# EAGLE design homeboard2 (EAGLE 6.0)
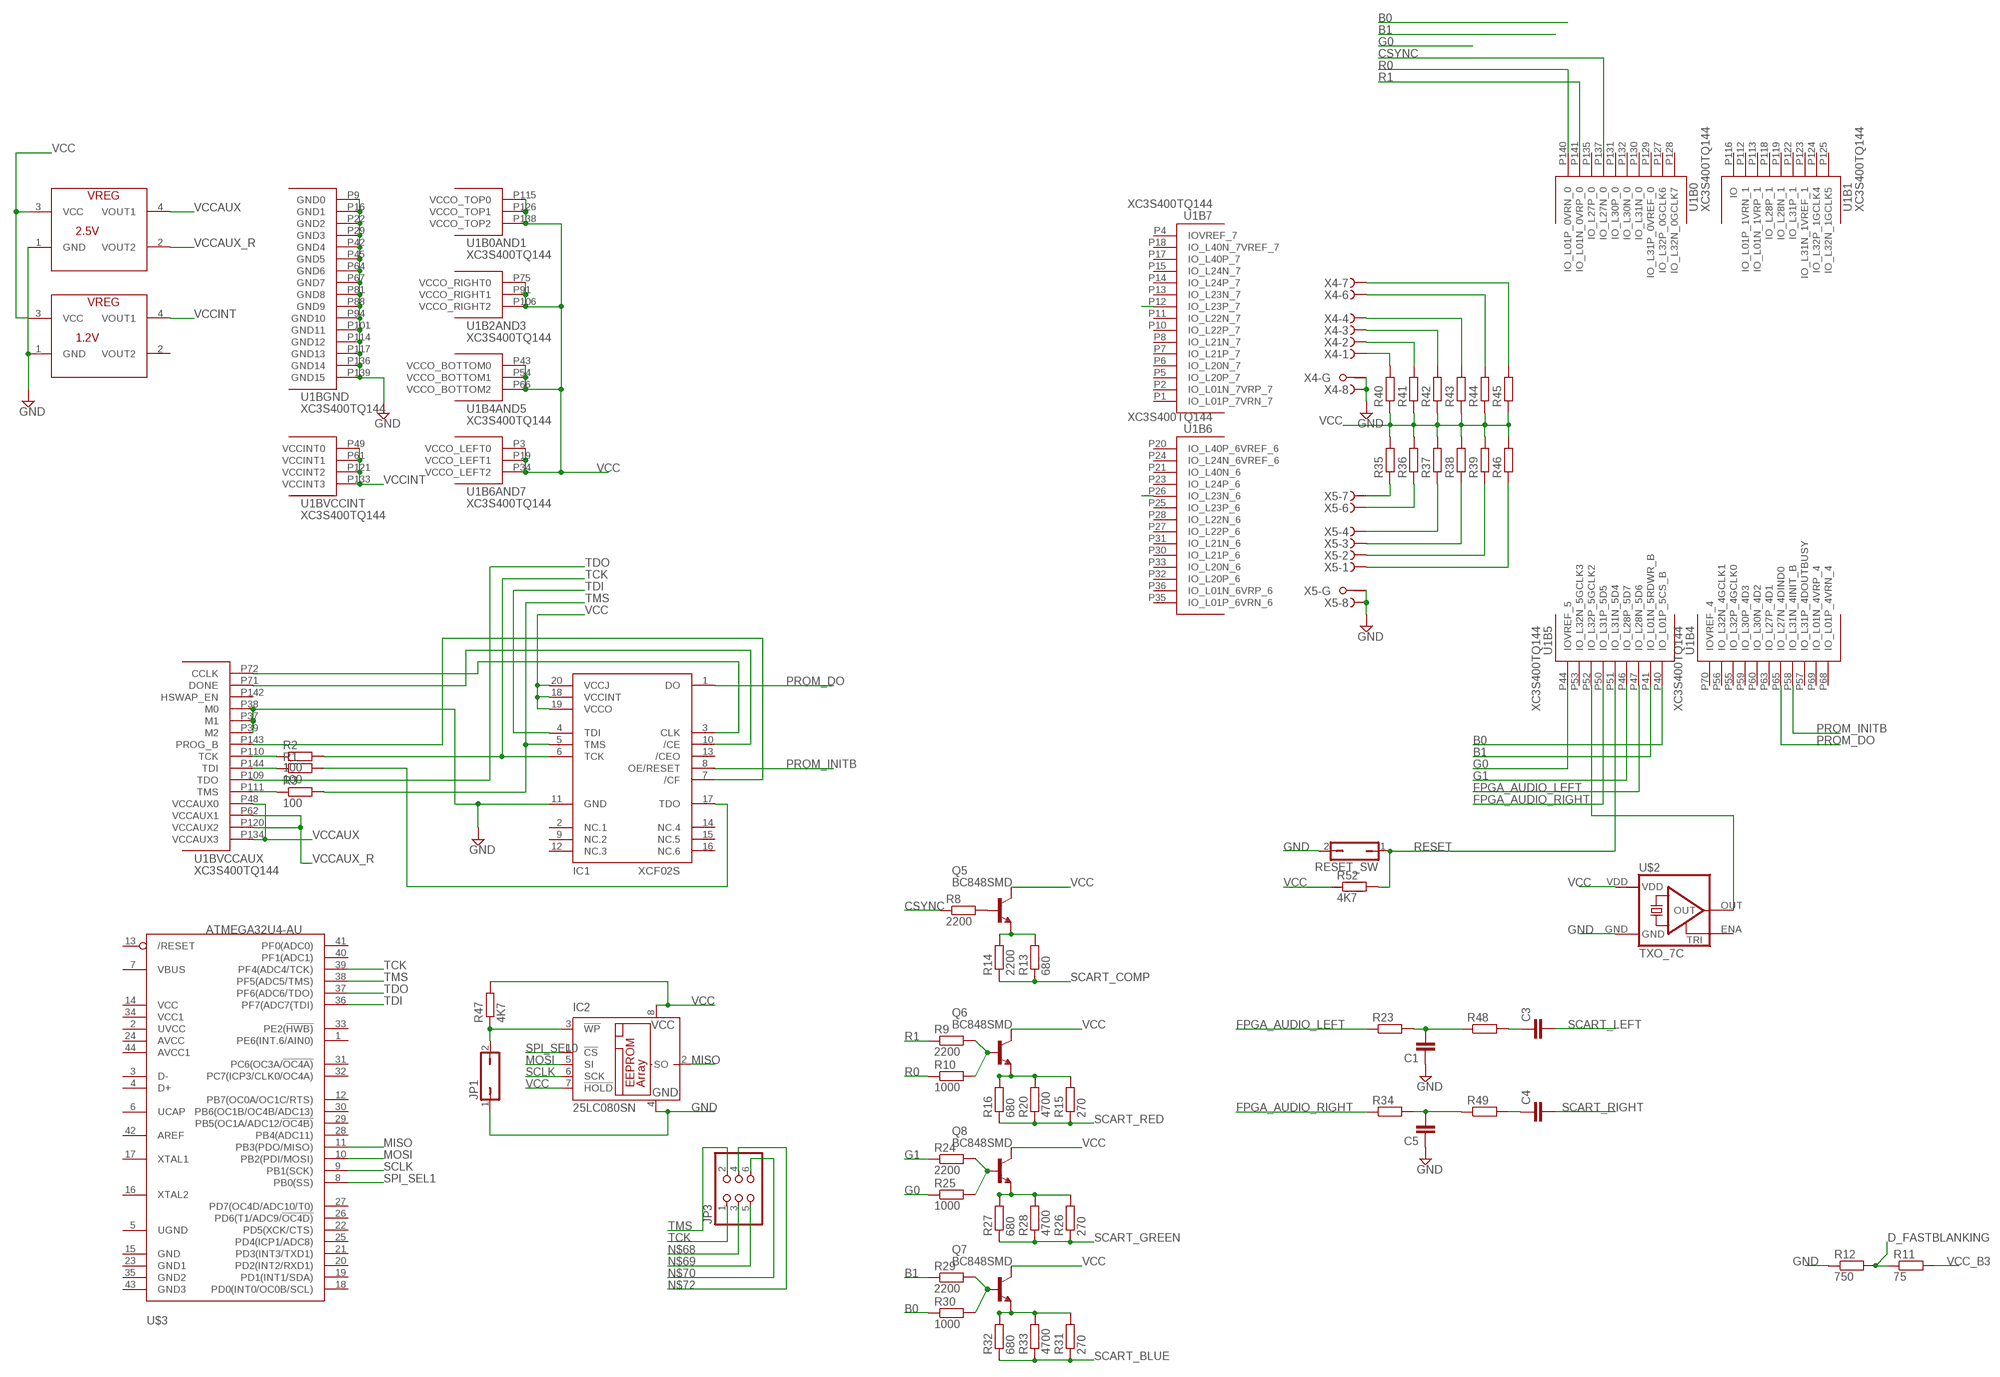
[diagram p0: schematic, sheet 1, part 1 of 3]
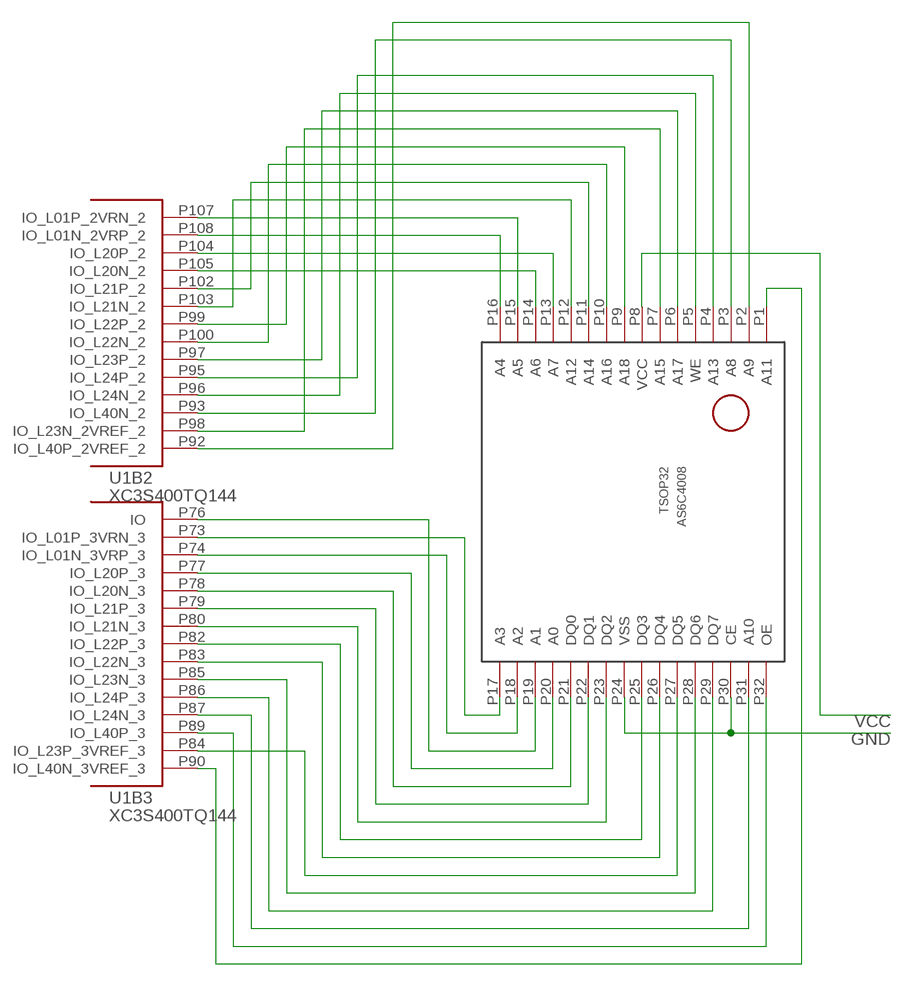
[diagram p1: schematic, sheet 1, part 2 of 3]
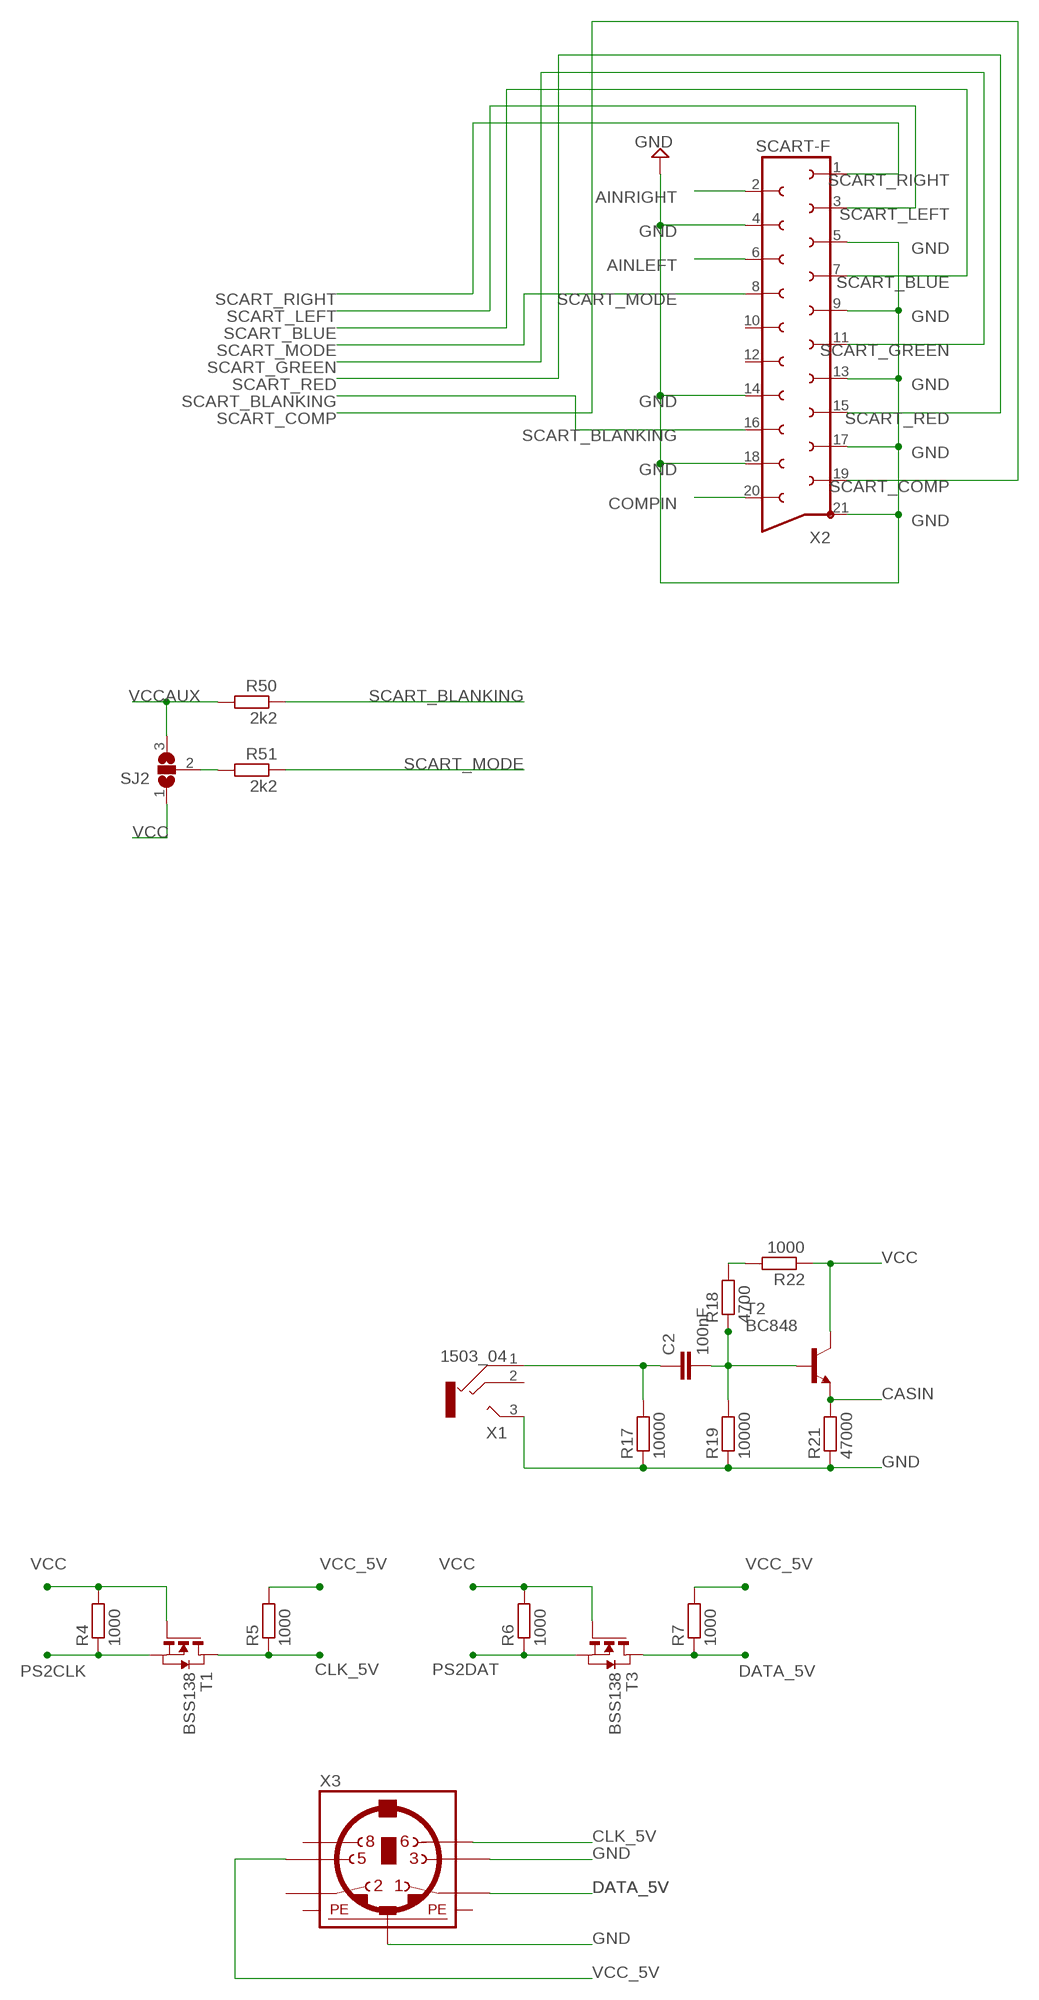
[diagram p2: schematic, sheet 1, part 3 of 3]

## Parts
C1  C-EUC0603  [C0603]
C2  100nF  C-EUC0603  [C0603]
C3  C-EUC0603  [C0603]
C4  C-EUC0603  [C0603]
C5  C-EUC0603  [C0603]
IC1  XCF02S  [VO20]
IC2  25LC080SN  [SO-08]
JP1  JP1Q  [JP1]
JP3  PINHD-2X3  [2X03]
Q5  BC848SMD  [SOT23]
Q6  BC848SMD  [SOT23]
Q7  BC848SMD  [SOT23]
Q8  BC848SMD  [SOT23]
R1  100  R-EU_R0805  [R0805]
R2  100  R-EU_R0805  [R0805]
R3  100  R-EU_R0805  [R0805]
R4  1000  R-EU_R0805  [R0805]
R5  1000  R-EU_R0805  [R0805]
R6  1000  R-EU_R0805  [R0805]
R7  1000  R-EU_R0805  [R0805]
R8  2200  R-EU_R0805  [R0805]
R9  2200  R-EU_R0805  [R0805]
R10  1000  R-EU_R0805  [R0805]
R11  75  R-EU_R0805  [R0805]
R12  750  R-EU_R0805  [R0805]
R13  680  R-EU_R0805  [R0805]
R14  2200  R-EU_R0805  [R0805]
R15  270  R-EU_R0805  [R0805]
R16  680  R-EU_R0805  [R0805]
R17  10000  R-EU_R0805  [R0805]
R18  4700  R-EU_R0805  [R0805]
R19  10000  R-EU_R0805  [R0805]
R20  4700  R-EU_R0805  [R0805]
R21  47000  R-EU_R0805  [R0805]
R22  1000  R-EU_R0805  [R0805]
R23  R-EU_M0805  [M0805]
R24  2200  R-EU_R0805  [R0805]
R25  1000  R-EU_R0805  [R0805]
R26  270  R-EU_R0805  [R0805]
R27  680  R-EU_R0805  [R0805]
R28  4700  R-EU_R0805  [R0805]
R29  2200  R-EU_R0805  [R0805]
R30  1000  R-EU_R0805  [R0805]
R31  270  R-EU_R0805  [R0805]
R32  680  R-EU_R0805  [R0805]
R33  4700  R-EU_R0805  [R0805]
R34  R-EU_M0805  [M0805]
R35  R-EU_M0805  [M0805]
R36  R-EU_M0805  [M0805]
R37  R-EU_M0805  [M0805]
R38  R-EU_M0805  [M0805]
R39  R-EU_M0805  [M0805]
R40  R-EU_M0805  [M0805]
R41  R-EU_M0805  [M0805]
R42  R-EU_M0805  [M0805]
R43  R-EU_M0805  [M0805]
R44  R-EU_M0805  [M0805]
R45  R-EU_M0805  [M0805]
R46  R-EU_M0805  [M0805]
R47  4K7  R-EU_R0805  [R0805]
R48  R-EU_M0805  [M0805]
R49  R-EU_M0805  [M0805]
R50  2k2  R-EU_M0805  [M0805]
R51  2k2  R-EU_M0805  [M0805]
R52  4K7  R-EU_M0805  [M0805]
REG1.2  1.2V  NX1117  [SOT223]
REG2.5  2.5V  NX1117  [SOT223]
RESET_SW  JP1Q  [JP1]
SJ2  SJ2W  [SJ_2]
T1  BSS138  NMOSSOT23  [SOT-23]
T2  BC848  [SOT23]
T3  BSS138  NMOSSOT23  [SOT-23]
U1  XC3S400TQ144  [TQ144]
U$1  AS6C4008  [TSOP32]
U$2  TXO_7C  [OSC_7C]
U$3  ATMEGA32U4-AU  [TQFP44]
X1  1503_04  [1503_04]
X2  SCART-F  [SCART-F]
X3  MINI_DIN_6  [M_DIN6]
X4  F09HPS  [F09HP]
X5  F09HPS  [F09HP]

## Nets
AINLEFT: X2.6
AINRIGHT: X2.2
B0: R30.1 U1.P40(B5:IO_L01P_5CS_B)
B1: R29.1 U1.P41(B5:IO_L01N_5RDWR_B)
CASIN: R21.2 T2.2(E)
CLK_5V: R5.1 T1.1(D) X3.6
COMPIN: X2.20
CSYNC: R8.1 U1.P137(B0:IO_L27N_0)
D_FASTBLANKING: R11.1 R12.2
DATA_5V: R7.1 T3.1(D) X3.1
FPGA_AUDIO_LEFT: R23.1 U1.P47(B5:IO_L28N_5D6)
FPGA_AUDIO_RIGHT: R34.1 U1.P50(B5:IO_L31P_5D5)
G0: R25.1 U1.P44(B5:IOVREF_5)
G1: R24.1 U1.P46(B5:IO_L28P_5D7)
GND: C1.1 C5.1 IC1.11(GND) IC2.4(GND) JP1.1 R12.1 R17.1 R19.1 R21.1 REG1.2.1(GND) REG2.5.1(GND) RESET_SW.2 U1.P9(BGND:GND0) U1.P16(BGND:GND1) U1.P22(BGND:GND2) U1.P29(BGND:GND3) U1.P37(BVCCAUX:M1) U1.P38(BVCCAUX:M0) U1.P39(BVCCAUX:M2) U1.P42(BGND:GND4) U1.P45(BGND:GND5) U1.P64(BGND:GND6) U1.P67(BGND:GND7) U1.P81(BGND:GND8) U1.P88(BGND:GND9) U1.P94(BGND:GND10) U1.P101(BGND:GND11) U1.P114(BGND:GND12) U1.P117(BGND:GND13) U1.P136(BGND:GND14) U1.P139(BGND:GND15) U$1.P24(VSS) U$1.P30(CE) U$2.GND X1.3 X2.4 X2.5 X2.9 X2.13 X2.14 X2.17 X2.18 X2.21 X3.3 X3.SH2(PE2) X4.8(-8:F) X4.G1(-G:G1) X5.8(-8:F) X5.G1(-G:G1)
MISO: IC2.2(SO) U$3.11(PB3(PDO/MISO))
MOSI: IC2.5(SI) U$3.10(PB2(PDI/MOSI))
N$1: U1.P108(B2:IO_L01N_2VRP_2) U$1.P16(A4)
N$2: U1.P107(B2:IO_L01P_2VRN_2) U$1.P15(A5)
N$3: U1.P105(B2:IO_L20N_2) U$1.P14(A6)
N$4: U1.P104(B2:IO_L20P_2) U$1.P13(A7)
N$5: U1.P103(B2:IO_L21N_2) U$1.P12(A12)
N$6: U1.P102(B2:IO_L21P_2) U$1.P11(A14)
N$7: U1.P100(B2:IO_L22N_2) U$1.P10(A16)
N$8: U1.P99(B2:IO_L22P_2) U$1.P9(A18)
N$9: U1.P98(B2:IO_L23N_2VREF_2) U$1.P7(A15)
N$10: U1.P97(B2:IO_L23P_2) U$1.P6(A17)
N$11: U1.P96(B2:IO_L24N_2) U$1.P5(WE)
N$12: U1.P95(B2:IO_L24P_2) U$1.P4(A13)
N$13: U1.P93(B2:IO_L40N_2) U$1.P3(A8)
N$14: U1.P92(B2:IO_L40P_2VREF_2) U$1.P2(A9)
N$15: U1.P90(B3:IO_L40N_3VREF_3) U$1.P1(A11)
N$16: U1.P73(B3:IO_L01P_3VRN_3) U$1.P17(A3)
N$17: U1.P74(B3:IO_L01N_3VRP_3) U$1.P18(A2)
N$18: U1.P76(B3:IO) U$1.P19(A1)
N$19: U1.P77(B3:IO_L20P_3) U$1.P20(A0)
N$20: U1.P78(B3:IO_L20N_3) U$1.P21(DQ0)
N$21: U1.P79(B3:IO_L21P_3) U$1.P22(DQ1)
N$22: U1.P80(B3:IO_L21N_3) U$1.P23(DQ2)
N$23: U1.P82(B3:IO_L22P_3) U$1.P25(DQ3)
N$24: U1.P83(B3:IO_L22N_3) U$1.P26(DQ4)
N$25: U1.P84(B3:IO_L23P_3VREF_3) U$1.P27(DQ5)
N$26: U1.P85(B3:IO_L23N_3) U$1.P28(DQ6)
N$27: U1.P86(B3:IO_L24P_3) U$1.P29(DQ7)
N$28: U1.P87(B3:IO_L24N_3) U$1.P31(A10)
N$29: U1.P89(B3:IO_L40P_3) U$1.P32(OE)
N$30: R35.1 X5.7(-7:F)
N$31: R36.1 X5.6(-6:F)
N$32: R37.1 X5.4(-4:F)
N$33: R38.1 X5.3(-3:F)
N$34: R39.1 X5.2(-2:F)
N$35: IC1.3(CLK) U1.P72(BVCCAUX:CCLK)
N$36: IC1.17(TDO) R1.2
N$37: R46.1 X5.1(-1:F)
N$38: IC1.10(/CE) U1.P71(BVCCAUX:DONE)
N$39: R2.1 U1.P110(BVCCAUX:TCK)
N$40: IC1.7(/CF) U1.P143(BVCCAUX:PROG_B)
N$41: R40.2 X4.1(-1:F)
N$42: R1.1 U1.P144(BVCCAUX:TDI)
N$43: R3.1 U1.P111(BVCCAUX:TMS)
N$44: R41.2 X4.2(-2:F)
N$45: R42.2 X4.3(-3:F)
N$46: R43.2 X4.4(-4:F)
N$47: R44.2 X4.6(-6:F)
N$48: R45.2 X4.7(-7:F)
N$49: IC2.3(!WP) JP1.2 R47.1
N$50: U1.P52(B5:IO_L32P_5GCLK2) U$2.OUT
N$51: C1.2 R23.2 R48.1
N$52: C3.1 R48.2
N$53: Q6.1(B) R9.2 R10.2
N$54: Q6.2(E) R15.2 R16.2 R20.2
N$55: Q8.1(B) R24.2 R25.2
N$56: Q8.2(E) R26.2 R27.2 R28.2
N$57: Q7.1(B) R29.2 R30.2
N$58: Q7.2(E) R31.2 R32.2 R33.2
N$59: Q5.2(E) R13.2 R14.2
N$60: C2.2 R18.1 R19.2 T2.1(B)
N$61: C2.1 R17.2 X1.1
N$62: R18.2 R22.2
N$63: Q5.1(B) R8.2
N$64: C4.1 R49.2
N$65: C5.2 R34.2 R49.1
N$66: R51.2 SJ2.2
N$67: U1.P26(B6:IO_L23N_6)
N$68: JP3.3
N$69: JP3.5
N$70: JP3.6
N$72: JP3.4
N$73: U1.P12(B7:IO_L23P_7)
PROM_DO: IC1.1(DO) U1.P65(B4:IO_L27N_4DIND0)
PROM_INITB: IC1.8(OE/RESET) U1.P58(B4:IO_L31N_4INIT_B)
PS2CLK: R4.1 T1.2(S)
PS2DAT: R6.1 T3.2(S)
R0: R10.1 U1.P140(B0:IO_L01P_0VRN_0)
R1: R9.1 U1.P141(B0:IO_L01N_0VRP_0)
RESET: R52.2 RESET_SW.1 U1.P51(B5:IO_L31N_5D4)
SCART_BLANKING: R50.1 X2.16
SCART_BLUE: R31.1 R32.1 R33.1 X2.7
SCART_COMP: R13.1 R14.1 X2.19
SCART_GREEN: R26.1 R27.1 R28.1 X2.11
SCART_LEFT: C3.2 X2.3
SCART_MODE: R51.1 X2.8
SCART_RED: R15.1 R16.1 R20.1 X2.15
SCART_RIGHT: C4.2 X2.1
SCLK: IC2.6(SCK) U$3.9(PB1(SCK))
SPI_SEL0: IC2.1(!CS)
SPI_SEL1: U$3.8(PB0(SS))
TCK: IC1.6(TCK) JP3.1 R2.2 U$3.39(PF4(ADC4/TCK))
TDI: IC1.4(TDI) U$3.36(PF7(ADC7(TDI))
TDO: U1.P109(BVCCAUX:TDO) U$3.37(PF6(ADC6/TDO))
TMS: IC1.5(TMS) JP3.2 R3.2 U$3.38(PF5(ADC5/TMS))
VCC: IC1.18(VCCINT) IC1.19(VCCO) IC1.20(VCCJ) IC2.7(!HOLD) IC2.8(VCC) Q5.3(C) Q6.3(C) Q7.3(C) Q8.3(C) R4.2 R6.2 R22.1 R35.2 R36.2 R37.2 R38.2 R39.2 R40.1 R41.1 R42.1 R43.1 R44.1 R45.1 R46.2 R47.2 R52.1 REG1.2.3(VCC) REG2.5.3(VCC) SJ2.1 T1.3(G) T2.3(C) T3.3(G) U1.P3(B6AND7:VCCO_LEFT0) U1.P19(B6AND7:VCCO_LEFT1) U1.P34(B6AND7:VCCO_LEFT2) U1.P43(B4AND5:VCCO_BOTTOM0) U1.P54(B4AND5:VCCO_BOTTOM1) U1.P66(B4AND5:VCCO_BOTTOM2) U1.P75(B2AND3:VCCO_RIGHT0) U1.P91(B2AND3:VCCO_RIGHT1) U1.P106(B2AND3:VCCO_RIGHT2) U1.P115(B0AND1:VCCO_TOP0) U1.P126(B0AND1:VCCO_TOP1) U1.P138(B0AND1:VCCO_TOP2) U$1.P8(VCC) U$2.VDD
VCC_5V: R5.2 R7.2 X3.5
VCC_B3: R11.2
VCCAUX: R50.2 REG2.5.4(VOUT1) SJ2.3 U1.P48(BVCCAUX:VCCAUX0) U1.P134(BVCCAUX:VCCAUX3)
VCCAUX_R: REG2.5.2(VOUT2) U1.P62(BVCCAUX:VCCAUX1) U1.P120(BVCCAUX:VCCAUX2)
VCCINT: REG1.2.4(VOUT1) U1.P49(BVCCINT:VCCINT0) U1.P61(BVCCINT:VCCINT1) U1.P121(BVCCINT:VCCINT2) U1.P133(BVCCINT:VCCINT3)
Unconnected: IC1.2(NC.1) IC1.9(NC.2) IC1.12(NC.3) IC1.13(/CEO) IC1.14(NC.4) IC1.15(NC.5) IC1.16(NC.6) REG1.2.2(VOUT2) U1.P1(B7:IO_L01P_7VRN_7) U1.P2(B7:IO_L01N_7VRP_7) U1.P4(B7:IOVREF_7) U1.P5(B7:IO_L20P_7) U1.P6(B7:IO_L20N_7) U1.P7(B7:IO_L21P_7) U1.P8(B7:IO_L21N_7) U1.P10(B7:IO_L22P_7) U1.P11(B7:IO_L22N_7) U1.P13(B7:IO_L23N_7) U1.P14(B7:IO_L24P_7) U1.P15(B7:IO_L24N_7) U1.P17(B7:IO_L40P_7) U1.P18(B7:IO_L40N_7VREF_7) U1.P20(B6:IO_L40P_6VREF_6) U1.P21(B6:IO_L40N_6) U1.P23(B6:IO_L24P_6) U1.P24(B6:IO_L24N_6VREF_6) U1.P25(B6:IO_L23P_6) U1.P27(B6:IO_L22P_6) U1.P28(B6:IO_L22N_6) U1.P30(B6:IO_L21P_6) U1.P31(B6:IO_L21N_6) U1.P32(B6:IO_L20P_6) U1.P33(B6:IO_L20N_6) U1.P35(B6:IO_L01P_6VRN_6) U1.P36(B6:IO_L01N_6VRP_6) U1.P53(B5:IO_L32N_5GCLK3) U1.P55(B4:IO_L32P_4GCLK0) U1.P56(B4:IO_L32N_4GCLK1) U1.P57(B4:IO_L31P_4DOUTBUSY) U1.P59(B4:IO_L30P_4D3) U1.P60(B4:IO_L30N_4D2) U1.P63(B4:IO_L27P_4D1) U1.P68(B4:IO_L01P_4VRN_4) U1.P69(B4:IO_L01N_4VRP_4) U1.P70(B4:IOVREF_4) U1.P112(B1:IO_L01P_1VRN_1) U1.P113(B1:IO_L01N_1VRP_1) U1.P116(B1:IO) U1.P118(B1:IO_L28P_1) U1.P119(B1:IO_L28N_1) U1.P122(B1:IO_L31P_1) U1.P123(B1:IO_L31N_1VREF_1) U1.P124(B1:IO_L32P_1GCLK4) U1.P125(B1:IO_L32N_1GCLK5) U1.P127(B0:IO_L32P_0GCLK6) U1.P128(B0:IO_L32N_0GCLK7) U1.P129(B0:IO_L31P_0VREF_0) U1.P130(B0:IO_L31N_0) U1.P131(B0:IO_L30P_0) U1.P132(B0:IO_L30N_0) U1.P135(B0:IO_L27P_0) U1.P142(BVCCAUX:HSWAP_EN) U$2.ENA(TRI) U$3.1(PE6(INT.6/AIN0)) U$3.2(UVCC) U$3.3(D-) U$3.4(D+) U$3.5(UGND) U$3.6(UCAP) U$3.7(VBUS) U$3.12(PB7(OC0A/OC1C/RTS)) U$3.13(/RESET) U$3.14(VCC) U$3.15(GND) U$3.16(XTAL2) U$3.17(XTAL1) U$3.18(PD0(INT0/OC0B/SCL)) U$3.19(PD1(INT1/SDA)) U$3.20(PD2(INT2/RXD1)) U$3.21(PD3(INT3/TXD1)) U$3.22(PD5(XCK/CTS)) U$3.23(GND1) U$3.24(AVCC) U$3.25(PD4(ICP1/ADC8)) U$3.26(PD6(T1/ADC9/!OC4D)) U$3.27(PD7(OC4D/ADC10/T0)) U$3.28(PB4(ADC11)) U$3.29(PB5(OC1A/ADC12/!OC4B)) U$3.30(PB6(OC1B/OC4B/ADC13)) U$3.31(PC6(OC3A/!OC4A)) U$3.32(PC7(ICP3/CLK0/OC4A)) U$3.33(PE2(!HWB)) U$3.34(VCC1) U$3.35(GND2) U$3.40(PF1(ADC1)) U$3.41(PF0(ADC0)) U$3.42(AREF) U$3.43(GND3) U$3.44(AVCC1) X1.2 X2.10 X2.12 X3.2 X3.8 X4.5(-5:F) X4.9(-9:F) X4.G2(-G:G2) X5.5(-5:F) X5.9(-9:F) X5.G2(-G:G2)

## Power pins joined to a net without a drawn wire
PE1: X3.SH1(PE1)
PE3: X3.SH3(PE3)

## Library data of the parts
C1-C5 = resistor:C-EU: CAPACITOR, European symbol
IC1 = smd-special:XCF02S
IC2 = microchip:25*: Serial EEPROM 4K/ 8K , SPI bus; MF: MICROCHIP; MPN: 25LC080/SN; OC_FARNELL: 1137302; OC_NEWARK: 96K4092
JP1 RESET_SW = jumper:JP1Q: JUMPER
JP3 = pinhead:PINHD-2X3: PIN HEADER
Q5-Q8 = bc548:BC848*: NPN Transistor
R1-R22 R24-R33 R47 = rcl:R-EU_: RESISTOR, European symbol
R23 R34-R46 R48-R52 = resistor:R-EU_: RESISTOR, European symbol
REG1.2 REG2.5 = cpcfpga:NX1117
SJ2 = jumper:SJ2W: SMD solder JUMPER
T1 T3 = zetex:NMOSSOT23: MOS FET; OC_FARNELL: unknown; OC_NEWARK: unknown
T2 = transistor:BC848: NPN TRANSISTOR
U1 = xilinx_spartan3_virtex4_and_5:XC3S400TQ144: Xilinx FPGA
U$1 = cpcfpga:AS6C4008
U$2 = cpcfpga:TXO_7C: TXC crystal oscillator http://www.txccrystal.com/images/pdf/7c.pdf
U$3 = adafruit:ATMEGA32U4: http://www.ladyada.net/library/eagle
X1 = con-lumberg:1503_04: Jack connectors according to JISC 6560, 3.5 mm, IP 57 Klinkensteckverbinder nach JISC 6560, 3,5 mm, IP 57 Source: http://www.lumberg.com/Produkte/PDFs/1503_04.pdf; OC_FARNELL: 1216981; OC_NEWARK: unknown
X2 = con-hirschmann:SCART-F: TV SCART CONNECTOR; OC_FARNELL: unknown; OC_NEWARK: unknown
X3 = mini_din:MINI_DIN_6
X4 X5 = con-subd:F09HPS: SUB-D; OC_FARNELL: unknown; OC_NEWARK: unknown

## Net classes
1 power: width 0.6 mm, drill 1.1 mm, clearance 0.4 mm

## Board
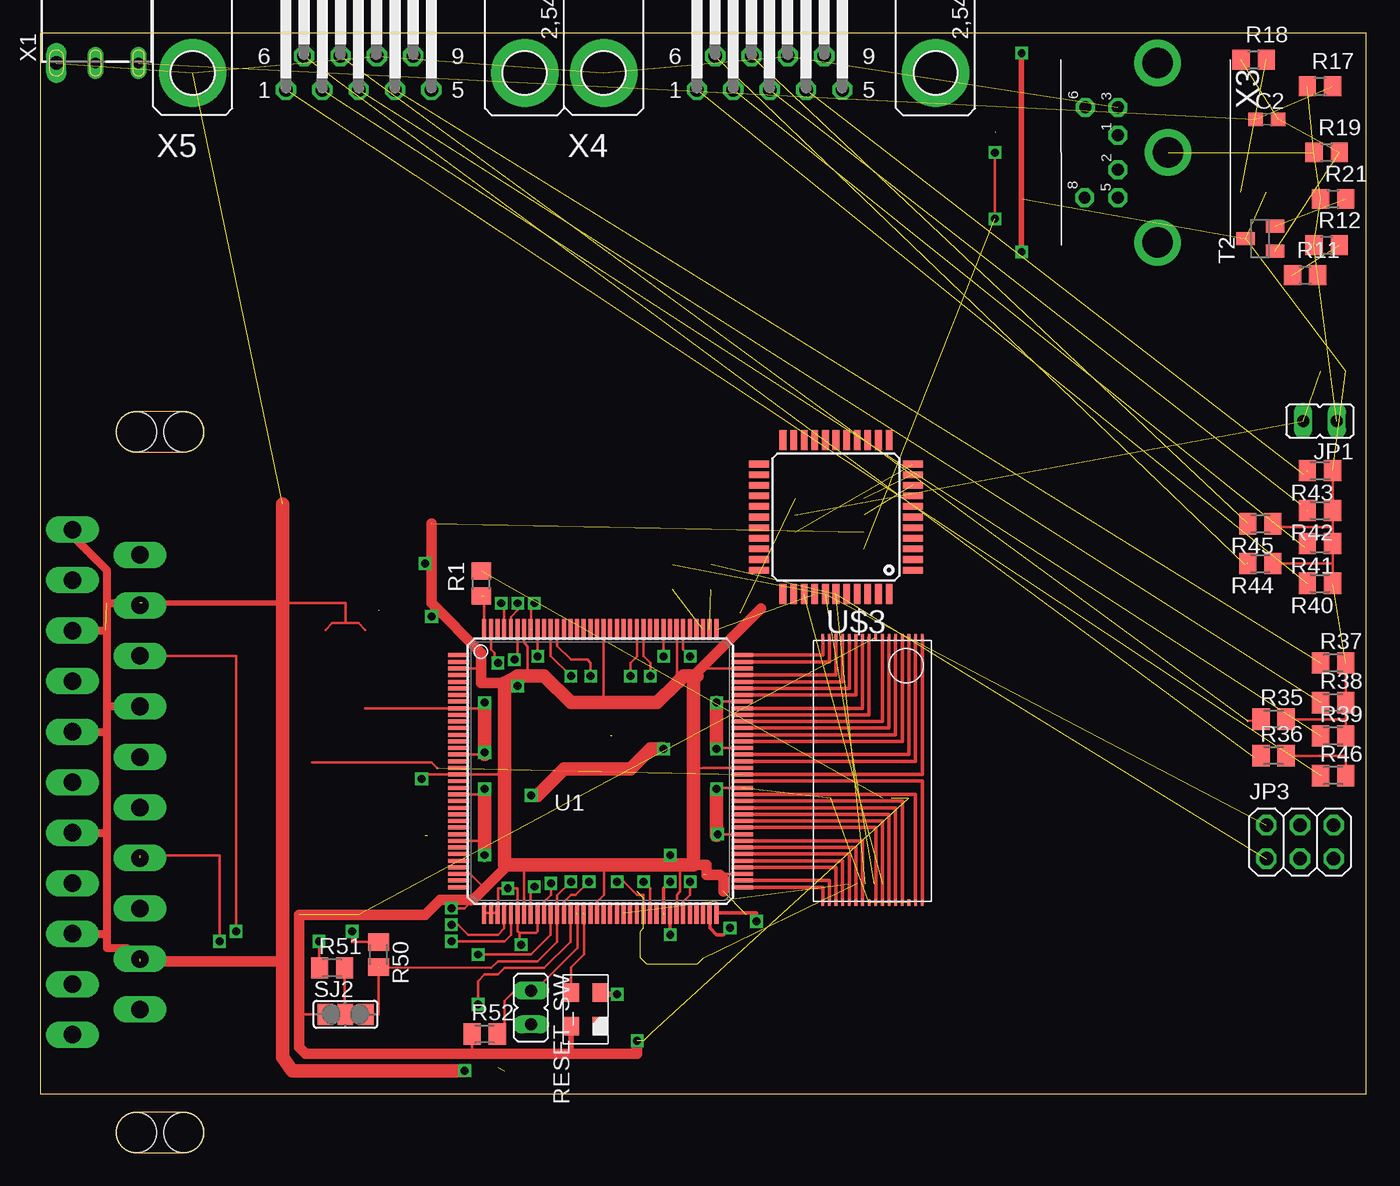
[diagram p3: board, top side]
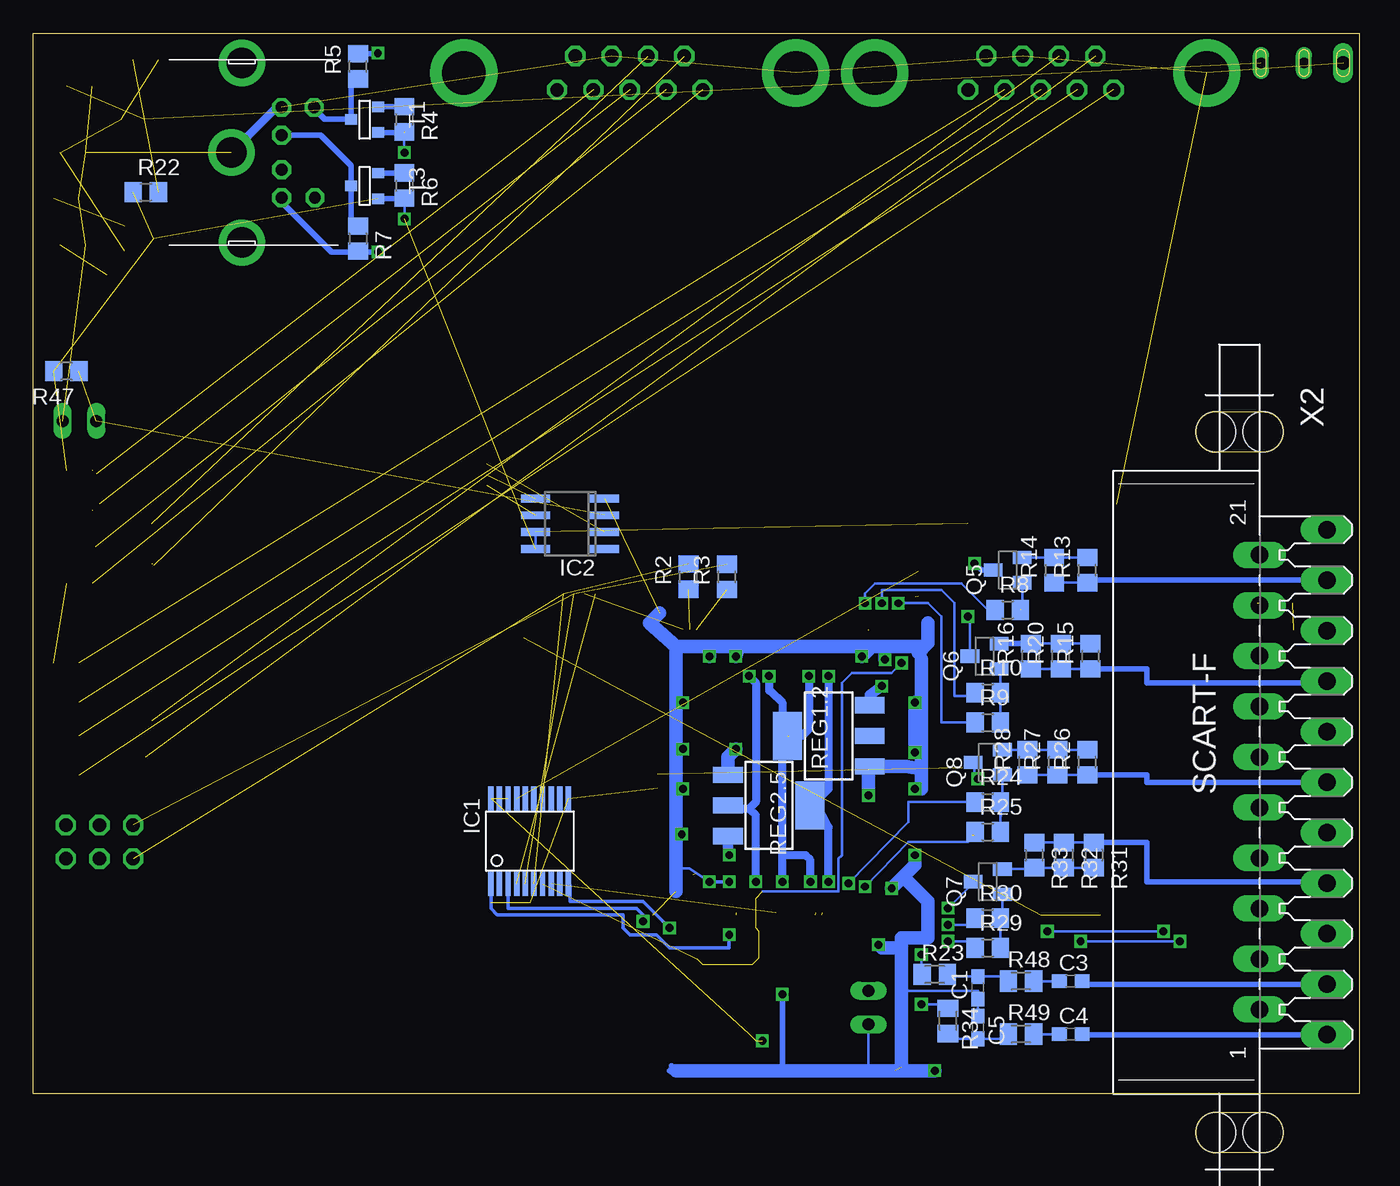
[diagram p4: board, bottom side, seen from below]

Size 100 x 80 mm. Coordinates in mm from the lower left corner, seen from the top.
Outline: 0,0 100,0 100,80 0,80 0,0
Copper layers (1*16): Top 0.0356mm / dielectric 1.5011mm / Bottom 0.0356mm
Design rules: minimum track width 6mil, minimum drill 13mil, track to track 6mil, track to pad 6mil, pad to pad 6mil, via to via 6mil, smd to smd 6mil, copper to edge 15mil, drill to drill 6mil, minimum pad ring 7mil, minimum via ring 7mil, stop-mask expansion 4mil, vias tented up to drill 0mil, thermal gap 10mil

### Footprints (pad centres in the part's own frame; a part is rotated, then mirrored left to right if it is on the bottom)
C0603 = smd 1.1 x 1: 1 -0.85,0; 2 0.85,0
VO20 = smd 0.4 x 1.8: 1 5.85,6.15; 2 5.2,6.15; 3 4.55,6.15; 4 3.9,6.15; 5 3.25,6.15; 6 2.6,6.15; 7 1.95,6.15; 8 1.3,6.15; 9 0.65,6.15; 10 0,6.15; 11 0,-0.3; 12 0.65,-0.3; 13 1.3,-0.3; 14 1.95,-0.3; 15 2.6,-0.3; 16 3.25,-0.3; 17 3.9,-0.3; 18 4.55,-0.3; 19 5.2,-0.3; 20 5.85,-0.3
SO-08 = smd 0.6 x 2.2: 1 -1.905,-2.6; 2 -0.635,-2.6; 3 0.635,-2.6; 4 1.905,-2.6; 5 1.905,2.6; 6 0.635,2.6; 7 -0.635,2.6; 8 -1.905,2.6
JP1 = drill 0.914 long: 1 0,-1.27; 2 0,1.27
2X03 = drill 1.016 octagon: 1 -2.54,-1.27; 2 -2.54,1.27; 3 0,-1.27; 4 0,1.27; 5 2.54,-1.27; 6 2.54,1.27
SOT23 = smd 1 x 1.4: 1 -0.95,-1.1; 2 0.95,-1.1; 3 0,1.1
R0805 = smd 1.3 x 1.5: 1 -0.95,0; 2 0.95,0
M0805 = smd 1.3 x 1.6: 1 -0.95,0; 2 0.95,0
SOT223 = smd 1.219 x 2.235: 1 -2.311,-3.099; 2 0,-3.099; 3 2.311,-3.099 | smd 3.6 x 2.2: 4 0,3.099
SJ_2 = smd 1.168 x 1.6: 1 -1.524,0; 2 0,0; 3 1.524,0
SOT-23 = smd 0.787 x 0.889: 1 0.025,-1.016; 2 -0.94,1.016; 3 0.991,1.016
TQ144 = smd 1.6 x 0.3: P1 -10.7,8.75; P2 -10.7,8.25; P3 -10.7,7.75; P4 -10.7,7.25; P5 -10.7,6.75; P6 -10.7,6.25; P7 -10.7,5.75; P8 -10.7,5.25; P9 -10.7,4.75; P10 -10.7,4.25; P11 -10.7,3.75; P12 -10.7,3.25; P13 -10.7,2.75; P14 -10.7,2.25; P15 -10.7,1.75; P16 -10.7,1.25; P17 -10.7,0.75; P18 -10.7,0.25; P19 -10.7,-0.25; P20 -10.7,-0.75; P21 -10.7,-1.25; P22 -10.7,-1.75; P23 -10.7,-2.25; P24 -10.7,-2.75; P25 -10.7,-3.25; P26 -10.7,-3.75; P27 -10.7,-4.25; P28 -10.7,-4.75; P29 -10.7,-5.25; P30 -10.7,-5.75; P31 -10.7,-6.25; P32 -10.7,-6.75; P33 -10.7,-7.25; P34 -10.7,-7.75; P35 -10.7,-8.25; P36 -10.7,-8.75; P73 10.7,-8.75; P74 10.7,-8.25; P75 10.7,-7.75; P76 10.7,-7.25; P77 10.7,-6.75; P78 10.7,-6.25; P79 10.7,-5.75; P80 10.7,-5.25; P81 10.7,-4.75; P82 10.7,-4.25; P83 10.7,-3.75; P84 10.7,-3.25; P85 10.7,-2.75; P86 10.7,-2.25; P87 10.7,-1.75; P88 10.7,-1.25; P89 10.7,-0.75; P90 10.7,-0.25; P91 10.7,0.25; P92 10.7,0.75; P93 10.7,1.25; P94 10.7,1.75; P95 10.7,2.25; P96 10.7,2.75; P97 10.7,3.25; P98 10.7,3.75; P99 10.7,4.25; P100 10.7,4.75; P101 10.7,5.25; P102 10.7,5.75; P103 10.7,6.25; P104 10.7,6.75; P105 10.7,7.25; P106 10.7,7.75; P107 10.7,8.25; P108 10.7,8.75 | smd 0.3 x 1.6: P37 -8.75,-10.7; P38 -8.25,-10.7; P39 -7.75,-10.7; P40 -7.25,-10.7; P41 -6.75,-10.7; P42 -6.25,-10.7; P43 -5.75,-10.7; P44 -5.25,-10.7; P45 -4.75,-10.7; P46 -4.25,-10.7; P47 -3.75,-10.7; P48 -3.25,-10.7; P49 -2.75,-10.7; P50 -2.25,-10.7; P51 -1.75,-10.7; P52 -1.25,-10.7; P53 -0.75,-10.7; P54 -0.25,-10.7; P55 0.25,-10.7; P56 0.75,-10.7; P57 1.25,-10.7; P58 1.75,-10.7; P59 2.25,-10.7; P60 2.75,-10.7; P61 3.25,-10.7; P62 3.75,-10.7; P63 4.25,-10.7; P64 4.75,-10.7; P65 5.25,-10.7; P66 5.75,-10.7; P67 6.25,-10.7; P68 6.75,-10.7; P69 7.25,-10.7; P70 7.75,-10.7; P71 8.25,-10.7; P72 8.75,-10.7; P109 8.75,10.7; P110 8.25,10.7; P111 7.75,10.7; P112 7.25,10.7; P113 6.75,10.7; P114 6.25,10.7; P115 5.75,10.7; P116 5.25,10.7; P117 4.75,10.7; P118 4.25,10.7; P119 3.75,10.7; P120 3.25,10.7; P121 2.75,10.7; P122 2.25,10.7; P123 1.75,10.7; P124 1.25,10.7; P125 0.75,10.7; P126 0.25,10.7; P127 -0.25,10.7; P128 -0.75,10.7; P129 -1.25,10.7; P130 -1.75,10.7; P131 -2.25,10.7; P132 -2.75,10.7; P133 -3.25,10.7; P134 -3.75,10.7; P135 -4.25,10.7; P136 -4.75,10.7; P137 -5.25,10.7; P138 -5.75,10.7; P139 -6.25,10.7; P140 -6.75,10.7; P141 -7.25,10.7; P142 -7.75,10.7; P143 -8.25,10.7; P144 -8.75,10.7
TSOP32 = smd 0.5 x 0.2: P1 -9.75,3.75; P2 -9.75,3.25; P3 -9.75,2.75; P4 -9.75,2.25; P5 -9.75,1.75; P6 -9.75,1.25; P7 -9.75,0.75; P8 -9.75,0.25; P9 -9.75,-0.25; P10 -9.75,-0.75; P11 -9.75,-1.25; P12 -9.75,-1.75; P13 -9.75,-2.25; P14 -9.75,-2.75; P15 -9.75,-3.25; P16 -9.75,-3.75; P17 10.25,-3.75; P18 10.25,-3.25; P19 10.25,-2.75; P20 10.25,-2.25; P21 10.25,-1.75; P22 10.25,-1.25; P23 10.25,-0.75; P24 10.25,-0.25; P25 10.25,0.25; P26 10.25,0.75; P27 10.25,1.25; P28 10.25,1.75; P29 10.25,2.25; P30 10.25,2.75; P31 10.25,3.25; P32 10.25,3.75
OSC_7C = smd 1.4 x 1.2: ENA -1.27,-1.1; GND 1.27,-1.1; OUT 1.27,1.1; VDD -1.27,1.1
TQFP44 = smd 1.5 x 0.5: 1 -5.8,4; 2 -5.8,3.2; 3 -5.8,2.4; 4 -5.8,1.6; 5 -5.8,0.8; 6 -5.8,0; 7 -5.8,-0.8; 8 -5.8,-1.6; 9 -5.8,-2.4; 10 -5.8,-3.2; 11 -5.8,-4; 23 5.8,-4; 24 5.8,-3.2; 25 5.8,-2.4; 26 5.8,-1.6; 27 5.8,-0.8; 28 5.8,0; 29 5.8,0.8; 30 5.8,1.6; 31 5.8,2.4; 32 5.8,3.2; 33 5.8,4 | smd 0.5 x 1.5: 12 -4,-5.8; 13 -3.2,-5.8; 14 -2.4,-5.8; 15 -1.6,-5.8; 16 -0.8,-5.8; 17 0,-5.8; 18 0.8,-5.8; 19 1.6,-5.8; 20 2.4,-5.8; 21 3.2,-5.8; 22 4,-5.8; 34 4,5.8; 35 3.2,5.8; 36 2.4,5.8; 37 1.6,5.8; 38 0.8,5.8; 39 0,5.8; 40 -0.8,5.8; 41 -1.6,5.8; 42 -2.4,5.8; 43 -3.2,5.8; 44 -4,5.8
1503_04 = drill 0.8 pad 1.2 long: 1 3.9,-10.25; 2 0.65,-10.25 | drill 1 pad 1.2 long: 3 -2.3,-10.25 | hole 1.6: 0,0
SCART-F = drill 1.321 long: 1 19.05,5.08; 2 17.145,0; 3 15.24,5.08; 4 13.335,0; 5 11.43,5.08; 6 9.525,0; 7 7.62,5.08; 8 5.715,0; 9 3.81,5.08; 10 1.905,0; 11 0,5.08; 12 -1.905,0; 13 -3.81,5.08; 14 -5.715,0; 15 -7.62,5.08; 16 -9.525,0; 17 -11.43,5.08; 18 -13.335,0; 19 -15.24,5.08; 20 -17.145,0; 21 -19.05,5.08 | hole 3.023: 26.416,0.254; 26.416,-3.302; -26.416,0.254; -26.416,-3.302
M_DIN6 = drill 0.9 pad 1.422 octagon: 1 -1.3,-3.75; 2 1.3,-3.75; 3 -3.4,-3.75; 5 3.4,-3.75; 6 -3.4,-6.2; 8 3.4,-6.25 | drill 2.3 pad 3.5: SH1 6.8,-0.75; SH2 0,0.05; SH3 -6.75,-0.75
F09HP = drill 1.016 octagon: 1 -5.486,-1.27; 2 -2.743,-1.27; 3 0,-1.27; 4 2.743,-1.27; 5 5.486,-1.27; 6 -4.115,1.27; 7 -1.372,1.27; 8 1.372,1.27; 9 4.115,1.27 | drill 3.302 pad 5.08: G1 -12.522,0; G2 12.522,0

### Placement (x,y rotation side)
C1  28.75,8 90 bottom
C2  92.5,73.5 0 top
C3  21.75,8.5 0 bottom
C4  21.75,4.5 0 bottom
C5  28.75,5 270 bottom
IC1  59.63,21.98 180 bottom
IC2  59.5,43 90 bottom
JP1  96.5,50.75 90 top
JP3  95,19 0 top
Q5  26.5,39.5 90 bottom
Q6  28.25,33 90 bottom
Q7  28,16 90 bottom
Q8  28,25 90 bottom
R1  33.25,38.49 90 top
R2  50.58,39 90 bottom
R3  47.68,38.99 90 bottom
R4  72,73.5 270 bottom
R5  75.5,77.5 90 bottom
R6  72,68.5 270 bottom
R7  75.5,64.5 270 bottom
R8  26.5,36.5 0 bottom
R9  28,28 0 bottom
R10  28,30.25 0 bottom
R11  95.38,61.75 0 top
R12  97,64 0 top
R13  20.5,39.5 90 bottom
R14  23,39.5 90 bottom
R15  20.25,33 90 bottom
R16  24.75,33 90 bottom
R17  96.5,76 0 top
R18  91.5,78 0 top
R19  97,71 0 top
R20  22.5,33 90 bottom
R21  97.5,67.5 0 top
R22  91.5,68 0 bottom
R23  32,9 0 bottom
R24  28,22 0 bottom
R25  28,19.75 0 bottom
R26  20.5,25 90 bottom
R27  22.75,25 90 bottom
R28  25,25 90 bottom
R29  28,11 0 bottom
R30  28,13.25 0 bottom
R31  20,18 270 bottom
R32  22.25,18 270 bottom
R33  24.5,18 270 bottom
R34  31,5.5 270 bottom
R35  93,28.25 0 top
R36  93,25.5 0 top
R37  97.5,32.5 0 top
R38  97.5,29.5 0 top
R39  97.5,27 0 top
R40  96.5,38.5 180 top
R41  96.5,41.5 180 top
R42  96.5,44 180 top
R43  96.5,47 180 top
R44  92,40 180 top
R45  92,43 180 top
R46  97.5,24 0 top
R47  97.5,54.5 180 bottom
R48  25.5,8.5 0 bottom
R49  25.5,4.5 0 bottom
R50  25.5,10.5 270 top
R51  22,9.5 0 top
R52  33.5,4.5 0 top
REG1.2  40,27 90 bottom
REG2.5  44.5,21.75 270 bottom
RESET_SW  37,6.5 180 top
SJ2  23,6 0 top
T1  75,73.5 270 bottom
T2  92,64.5 90 top
T3  75,68.5 270 bottom
U1  42.23,24.33 0 top
U$1  62.75,24.67 270 top
U$2  41.12,6.38 90 top
U$3  60,43.5 180 top
X1  3.5,88 0 top
X2  7.5,23.5 270 bottom
X3  85,71 270 top
X4  55,77 0 top
X5  24,77 0 top

### Tracks (layer width: path | path; a pad name or v marks a point on that pad's centre or on a via)
B0  (via drill 0.6)
  Top 0.2: U1.P40 34.98,12.47 34.5,12 32.25,12 31.5,12.75 v31,12.75
  Bottom 0.2: 28.95,13 R30.1 29.45,12.75 v31,12.75
B1  (via drill 0.6)
  Top 0.2: U1.P41 35.48,11.97 35,11.5 v31,11.5
  Bottom 0.2: 29.45,11.5 R29.1 28.95,11.5 v31,11.5
CASIN  (1 unrouted)
CLK_5V
  Bottom 0.3: 76.02,76.03 R5.1
  Bottom 0.4: X3.6 78.8,74.3 78,73.5 76.04,73.5 T1.1 76.02,76.03
CSYNC  (via drill 0.6)  (1 unrouted)
  Top 0.2: 37,35 37,36.75 v37.25,37
  Bottom 0.2: 27.45,37 R8.1 28,36.5 30,38.5 36.5,38.5 37.25,37.75 v37.25,37
D_FASTBLANKING  (1 unrouted)
DATA_5V
  Bottom 0.4: R7.1 76.02,65.97 T3.1 76,68.49 76,70 78.3,72.3 X3.1
FPGA_AUDIO_LEFT  (via drill 0.6)
  Top 0.2: U1.P47 38.48,11.97 37,10.5 v33,10.5
  Bottom 0.2: R23.1 33,8.55 v33,10.5
FPGA_AUDIO_RIGHT  (via drill 0.6)
  Top 0.2: U1.P50 39.98,11.47 38,9.5 35,9.5 34.5,9 33.5,9 33,8.5 v33,6.75
  Bottom 0.2: R34.1 31.7,6.45 31.7,6.75 v33,6.75
G0  (via drill 0.6)  (1 unrouted)
  Top 0.2: U1.P44 36.98,15.47 v37.25,15.62
  Bottom 0.2: 29.2,19.5 R25.1 | v37.25,15.62 34,19 29.5,19 29,19.5
G1  (via drill 0.6)
  Top 0.2: U1.P46 37.98,14.47 38.5,15 v38.5,15.88
  Bottom 0.2: v38.5,15.88 34,20.5 34,22 R24.1
GND  (via drill 0.6)  (20 unrouted)
  Top 0.2: 24.5,29.08 U1.P9 33.5,29.08 33.5,29 | 21.5,35 22,35.5 23,35.5 | 24.5,35 24,35.5 23,35.5 | U1.P16 33.5,25.58 33.5,25.5 | U1.P22 33.5,22.58 33.5,22.5 | U1.P29 33.5,19.08 | U1.P37 U1.P38 U1.P39 34.5,13.65 34.5,15.5 v35.25,15.5 36,15.5 | U1.P45 37.5,13.61 37.5,12.25 37.38,12.12 36.12,12.12 | 36,13.65 U1.P42 | U1.P42 35.98,15.47 | 36.12,12.12 36,12.25 36,13.61 U1.P42 | U1.P136 37.5,35.01 v37.5,33 | U1.P139 35.98,32.98 v35.75,32.75 | 36.12,12.12 36.12,11.38 v36.25,11.25 | 18.09,36.84 18.25,37 | 23,35.5 23,37 18.5,37 | U1.P101 51.08,29.58 v51,29.5 | U1.P88 51.08,23.08 v51,23 | U1.P81 v51.08,19.58 51,19.5 | U1.P94 51.08,26.08 v51,26 | U1.P117 46.98,33.02 v47,33 | U1.P114 48.48,33.52 v49,33 | U1.P67 48.48,14.47 49,15 v49,16
  Top 0.254: 47,13.5 47,15.5 v47.5,16
  Top 0.4: X2.21 2.42,42.08 | 5.21,29.21 5,29 | v43.5,7.5 42.5,7.5 42.35,7.64 U$2.GND | 18.5,37 7.67,37
  Top 0.406: 4.81,27.31 5,27.5 | 4.81,19.69 5,19.5 | 4.93,34.93 4.93,35 4.86,34.93 | 4.93,12.07 5,12
  Top 0.6: 2.42,42.08 5,39.5 5,37 | 5,37 5,29 5,27.5 5,19.5 5,12 5,11 6.5,11 7.5,10 | X2.13 4.81,27.31 | X2.9 4.81,19.69 | X2.17 4.86,34.93 | X2.5 4.93,12.07 | 33.5,29.08 v33.5,29.5 | X2.14 5.21,29.21 | 5,37 7.5,37
  Top 0.8: 33.5,25.5 v33.5,25.75 | v33.5,23 33.5,22.5 | 7.5,10 18.25,10 | 7.67,37 X2.18
  Top 1: 33.5,22.5 33.5,19.08 v33.5,18 | 33.5,25.58 33.5,29 | 18.25,44.5 18.25,37 18.25,10 18.25,2.75 19,1.75 v32,1.75 | v47,26 46,26 44.5,24.5 39.5,24.5 37.5,22.5 v37,22.5 | v51,29.5 v51,26 | v51,23 51,19.5
  Bottom 0.2: v36.25,11.25 36.25,11 | 28.75,6.25 28.5,6 29,6 28.85,5.85 C5.1 C1.1 28.75,7.75 34.5,7.75 | RESET_SW.2 37,1.75 | v51,29.5 51.5,28.75 | v51,23 51.5,22.75 | v51,26 51.5,25.75 | v51.08,19.58 51.42,19.58 51.5,19.25 | v49,16 50.5,17 51.5,17 | 35.75,33.25 36,33.75
  Bottom 0.254: v47.5,16 v49,16
  Bottom 0.4: 52,1.75 51.87,1.75 | v43.5,7.5 43.5,1.75 | 51.87,2.12 51.5,1.75
  Bottom 0.6: X3.3 81.65,74.4 X3.SH2 | 34.25,16.25 34.5,16.25 | 51.87,1.75 51.5,1.75
  Bottom 0.8: 37,24.59 REG1.2.1 | 33,33.75 33,32.75 33.25,33.25
  Bottom 1: v33.5,25.75 33,30 | 33,29.5 33,25.75 | v33.5,25.75 33,25.75 | 33,25.75 33,24.5 | 33,24.5 33,23 v33.5,23 | v35.25,15.5 34.5,16.25 33.5,17.25 v33.5,18 | 34.5,11 34.5,11.75 32.5,11.75 32.5,14.5 34.25,16.25 | 34.5,11 34.5,7.75 34.5,2 | 33,29.5 v33.5,29.5 v33.5,25.75 | 33,29.5 33,30 | 33,30 33,32.75 | 33,33.75 36,33.75 36.75,33.75 | v36.25,11.25 36,11 34.5,11 | 35,1.75 v32,1.75 37,1.75 43.5,1.75 51.5,1.75 | REG1.2.1 34.19,24.69 33,24.5 | REG2.5.1 47.6,25.4 v47,26 | v37,22.5 37,24.59 | 46.75,33.75 36.75,33.75 | 36.75,33.75 v37.5,33 | 49,33.75 51.5,33.75 | 51.5,33.75 51.5,28.75 51.5,25.75 51.5,22.75 51.5,19.25 51.5,17 51.5,15.25 | v47,33 46.75,33.75 | 46.75,33.75 49,33.75 | 49,33.75 v49,33 | 51.5,33.75 53.5,35.5 52.75,36.25 | v35.75,32.75 35.75,33.25 | 32.5,35.5 32.5,34 33.25,33.25
MISO  (1 unrouted)
MOSI  (1 unrouted)
N$1
  Top 0.254: U1.P108 59,33.08 U$1.P16
N$2
  Top 0.254: U1.P107 59.5,32.58 U$1.P15
N$3
  Top 0.254: U1.P105 60,31.58 U$1.P14
N$4
  Top 0.254: U1.P104 60.5,31.08 U$1.P13
N$5
  Top 0.254: U1.P103 61,30.58 U$1.P12
N$6
  Top 0.254: U1.P102 61.5,30.08 U$1.P11
N$7
  Top 0.254: U1.P100 62,29.08 U$1.P10
N$8
  Top 0.254: U1.P99 62.5,28.58 U$1.P9
N$9
  Top 0.254: U1.P98 63.5,28.08 U$1.P7
N$10
  Top 0.254: U1.P97 64,27.58 U$1.P6
N$11
  Top 0.254: U1.P96 64.5,27.08 U$1.P5
N$12
  Top 0.254: U1.P95 65,26.58 U$1.P4
N$13
  Top 0.254: U1.P93 65.5,25.58 U$1.P3
N$14
  Top 0.254: U1.P92 66,25.08 U$1.P2
N$15  (1 unrouted)
  Top 0.2: 29.92,24.58 29.5,25 20.5,25
  Top 0.254: U1.P90 66.5,24.08 U$1.P1
N$16
  Top 0.254: U1.P73 59,15.58 U$1.P17
N$17
  Top 0.254: U1.P74 59.5,16.08 U$1.P18
N$18
  Top 0.254: U1.P76 60,17.08 U$1.P19
N$19
  Top 0.254: U1.P77 60.5,17.58 U$1.P20
N$20
  Top 0.254: U1.P78 61,18.08 U$1.P21
N$21
  Top 0.254: U1.P79 61.5,18.58 U$1.P22
N$22
  Top 0.254: U1.P80 62,19.08 U$1.P23
N$23
  Top 0.254: U1.P82 63,20.08 U$1.P25
N$24
  Top 0.254: U1.P83 63.5,20.58 U$1.P26
N$25
  Top 0.254: U1.P84 64,21.08 U$1.P27
N$26
  Top 0.254: U1.P85 64.5,21.58 U$1.P28
N$27
  Top 0.254: U1.P86 65,22.08 U$1.P29
N$28
  Top 0.254: U1.P87 66,22.58 U$1.P31
N$29
  Top 0.254: U1.P89 66.5,23.58 U$1.P32
N$30  (1 unrouted)
  Top 0.2: 91.05,28.13 R35.1
N$31  (1 unrouted)
  Top 0.2: 91.55,25.39 R36.1
N$32  (1 unrouted)
N$33  (1 unrouted)
N$34  (1 unrouted)
  Top 0.2: 96.55,26.88 R39.1
N$35  (via drill 0.6)
  Top 0.2: 51,13.65 U1.P72
  Top 0.254: 51,13.65 54,13.65 v54,13
  Bottom 0.254: v54,13 54,13.5 54.5,14 64.18,14 IC1.3
N$36  (1 unrouted)
N$37  (1 unrouted)
N$38  (via drill 0.6)
  Top 0.254: U1.P71 50.5,13.63 50.5,12.5 51,12 51.5,12 v52,12.5
  Bottom 0.254: v52,12.5 54,14.5 59.5,14.5 59.5,15.7 IC1.10
N$39  (1 unrouted)
N$40  (via drill 0.6)  (8 unrouted)
  Top 0.2: U1.P143 33.98,33.52 34.25,33.25 34.25,32.75 v34.5,32.5
  Bottom 0.2: 45,15.25 39.25,15.25 39.25,17.75 39,18 39,31 38.25,31.75 35.25,31.75 v34.5,32.5
N$41  (1 unrouted)
  Top 0.2: 95.54,38.51 R40.2
N$42  (1 unrouted)
  Top 0.2: U1.P144 33.48,37.5 33,37.5
N$43  (1 unrouted)
N$44  (1 unrouted)
  Top 0.2: 95.31,41.26 R41.2
N$45  (2 unrouted)
  Top 0.2: 95,44.5 95.5,44
N$46  (2 unrouted)
  Top 0.2: 95.24,46.74 95.5,47
N$47  (2 unrouted)
  Top 0.2: 90.89,39.88 91,40
N$48  (1 unrouted)
N$49  (2 unrouted)
N$50  (1 unrouted)
  Top 0.2: U$2.OUT 40.02,9.53 41,10.5 41,13.5
N$51
  Bottom 0.2: R23.2 30.7,8.85 C1.2 26.8,8.85 R48.1
N$52
  Bottom 0.2: R48.2 C3.1
N$53
  Bottom 0.2: Q6.1 27.05,32.05 R10.2 R9.2
N$54
  Bottom 0.2: R15.2 R20.2 R16.2
  Bottom 0.4: Q6.2 25.05,33.95 25,34 24.8,34 R16.2
N$55
  Bottom 0.2: Q8.1 26.9,22.1 27,22 R25.2 R24.2
N$56
  Bottom 0.2: R26.2 R27.2 R28.2 Q8.2
N$57
  Bottom 0.2: R29.2 R30.2 26.9,13.25 Q7.1
N$58
  Bottom 0.2: Q7.2 24.5,16.95 R33.2 R32.2 R31.2
N$59
  Bottom 0.2: R13.2 R14.2 Q5.2
N$60  (3 unrouted)
N$61  (2 unrouted)
N$62  (1 unrouted)
N$63  (1 unrouted)
  Bottom 0.2: Q5.1 25.4,36.6 25.5,36.5
N$64
  Bottom 0.2: C4.1 R49.2
N$65
  Bottom 0.2: R49.1 26.8,4.15 C5.2 30.7,4.15 R34.2
N$66
  Top 0.2: SJ2.2 22.95,6 R51.2
PROM_DO  (via drill 0.6)
  Top 0.254: U1.P65 47.48,12.03 v47.5,12
  Bottom 0.254: IC1.1 65.48,13.98 65,13.5 55.5,13.5 55.5,12.5 55,12 53,12 52,11 47.5,11 v47.5,12
PROM_INITB  (1 unrouted)
PS2CLK
  Bottom 0.4: T1.2 R4.1
PS2DAT
  Bottom 0.4: R6.1 T3.2
R0  (via drill 0.6)
  Top 0.2: U1.P140 35.48,35.98 36,36.5 v36,37
  Bottom 0.2: 29.2,30.5 R10.1 28.95,30 30.5,30 30.5,37 31.5,38 36,38 v36,37
R1  (via drill 0.6)
  Top 0.2: U1.P141 34.98,36.77 v34.75,37
  Bottom 0.2: R9.1 31.5,28 31.5,36 32.5,37 v34.75,37
RESET  (1 unrouted)
  Top 0.2: 40.5,13.5 40.5,11 37.25,7.75 RESET_SW.1 35.77,7.77 35,7 35,5.05 R52.2
SCART_BLANKING  (via drill 0.6)
  Top 0.2: R50.1 23.5,11.45 v23.5,12.25 | X2.16 14.75,33.02 v14.75,12.25
  Bottom 0.2: v14.75,12.25 v23.5,12.25
SCART_BLUE
  Bottom 0.2: R31.1 R32.1 R33.1
  Bottom 0.4: R31.1 16,18.95 16,16 2.54,16 X2.7
SCART_COMP
  Bottom 0.2: R14.1 R13.1 20.5,38.5
  Bottom 0.4: X2.19 20.26,38.74 20.5,38.5
SCART_GREEN
  Bottom 0.2: R28.1 R27.1 R26.1
  Bottom 0.4: R26.1 16,24.05 16,23.5 X2.11
SCART_LEFT
  Bottom 0.2: 20.66,8.26 C3.2
  Bottom 0.4: X2.3 20.66,8.26
SCART_MODE  (via drill 0.6)  (1 unrouted)
  Top 0.2: 21,9.5 v21,11.5 | v13.5,11.5 13.5,18 7.5,18
  Top 0.4: R51.1 21,9.5 | 7.5,17.5 7.5,18
  Bottom 0.2: v21,11.5 v13.5,11.5
SCART_RED
  Bottom 0.2: R15.1 R20.1 R16.1
  Bottom 0.4: R15.1 16,32.05 16,31 2.54,31 X2.15
SCART_RIGHT
  Bottom 0.2: 20.85,4.45 C4.2
  Bottom 0.4: X2.1 20.85,4.45
SCLK  (1 unrouted)
TCK  (3 unrouted)
TDI  (1 unrouted)
TDO  (1 unrouted)
TMS  (3 unrouted)
VCC  (via drill 0.6)  (17 unrouted)
  Top 0.2: R46.2 98.45,25.5 | 98.45,25.5 R39.2 98.45,28.25 | 98.45,28.25 R38.2 R37.2 | R35.2 98.45,28.25 | R36.2 98.45,25.5 | R40.1 97.45,40 | 97.45,40 R41.1 97.45,42.62 | 97.45,42.62 R42.1 R43.1 | R44.1 97.45,40 | R45.1 93.38,43 93.62,42.75 97.33,42.75 97.45,42.62 | 36.5,13.63 U1.P43 36.48,17.25 36.48,17.48 36.5,17.5 | 35,25.5 34.5,24.08 U1.P19 29.08,24.08 v28.75,23.75 | v72,71 v72,66 | U1.P75 50,16.58 | U1.P106 50,32.08 49.5,31.5 | U1.P91 50,24.58 49.25,24.5 | U1.P34 32.42,16.58 33.5,15.5 | v29.5,36 29.5,37 | v29,40 29.5,40 | v31,14 32,14 32.5,14.5 | SJ2.1 19.5,6 | U1.P66 48,13.63 48,15 48.25,15.25 48.25,17.25 | R52.1 32.55,3.05 32.5,3 | U1.P126 42.48,29.52 42.5,29.5 | U1.P115 48,35.03 48,31 | U1.P54 41.98,14.47 42.5,15 42.5,17 42.75,17 43,17.25 | 46.5,17 47,17.5 47.5,17.5 47.75,17.5 48,17.25 | U1.P3 32.92,32.08 33,32 33.25,32 | U1.P138 36.48,34.02 36.75,33.75 36.75,31.5 | 33.25,31 33.25,31.75 33.5,32
  Top 0.4: U$2.VDD 40.02,3.02 42,3
  Top 0.6: 32.5,14.5 32.62,14.62 | 35,17.25 35,17
  Top 0.8: 36.75,31.5 36.5,31.5 | 35,31 33.25,31 33.25,32 33.25,33.25 29.5,37 29.5,40 29.5,43 | v47.5,18 47.5,17.5 | v36,30.75 36,31.5 | 35,17 33.5,15.5 32.62,14.62 30.12,14.62 29,13.5 19.5,13.5 19.5,6 19.5,3.5 20,3 32.5,3 42,3 45,3 v45,4 | 51.5,15.25 51.5,16.25 51.25,16.5 50.25,16.5 50.25,17.25 49.25,17.25 | 54.34,36.59 49.25,31.5
  Top 1: 49.25,31.5 49.25,24.5 49.25,17.25 48.25,17.25 48,17.25 43,17.25 36.48,17.25 35,17.25 35,25.5 35,31 36,31.5 36.5,31.5 36.48,31.52 | 49.25,31.5 49.5,31.5 | 49.25,31.5 48.5,31.5 48,31 46.5,29.5 42.5,29.5 40,29.5 38,31.5 36.75,31.5
  Bottom 0.2: 71.55,72.55 71.55,72.95 71.5,73 | 72.01,72.51 v72.01,71.01 v72,71 | v72,66 R6.2 | IC2.7 IC2.8 | Q8.3 29.5,25 29,24.5 29,24 v28.75,23.75 | Q7.3 29.1,15.9 v31,14 | Q6.3 29.35,35.85 v29.5,36 | Q5.3 27.6,39.4
  Bottom 0.4: T1.3 72.01,72.51 72,72.5 | T3.3 72.04,67.51 R6.2 | R4.2 71.55,72.55 71.5,72.5 | Q5.3 28.5,39.5 v29,40 | 47.6,18.1 v47.5,18
  Bottom 0.8: REG2.5.3 47.6,18.1 | REG1.2.3 36.9,30.1 v36,30.75
VCC_5V  (via drill 0.6)
  Top 0.4: v74,78.5 v74,63.5
  Bottom 0.4: X3.5 81.25,67.25 77.5,63.5 75.55,63.5 R7.2 75.5,63.5 v74,63.5 | R5.2 74.05,78.45 v74,78.5
VCCAUX  (via drill 0.6)  (1 unrouted)
  Top 0.2: R50.2 34,9.5 34.5,10 37.5,10 38.98,11.47 U1.P48 38.98,14.97 v40,16 | SJ2.3 25.5,6 25.5,9.5 | U1.P134 38.48,33.02 v40,31.5
  Bottom 0.2: 40.95,21.95 REG2.5.4
  Bottom 0.6: v40,31.5 40,23 41,22 40.95,21.95 40,20.12 v40,16
VCCAUX_R  (via drill 0.6)
  Top 0.2: U1.P62 45.98,15.47 46,15.5 v45.5,16 | U1.P120 45.48,33.02 46,32.5 v46,31.5
  Bottom 0.6: v46,31.5 45.5,31 45.5,22 46,21.5 | 46,21.5 47.5,21.5 47.6,21.6 REG2.5.2 | v45.5,16 45.5,21 46,21.5
VCCINT  (via drill 0.6)  (1 unrouted)
  Top 0.2: U1.P49 39.48,14.47 40,15 40.38,15 v41.38,16 | U1.P61 45.48,14.97 45.5,15 45,15 44,16 v43.5,16 | U1.P133 38.98,33.77 40,32.75 41.25,32.75 41.5,32.5 v41.5,31.5 | U1.P121 44.98,32.98 44.5,32.5 v44.5,31.5
  Bottom 0.2: 43.5,26.6 REG1.2.4 43.1,27.4 43,27.5
  Bottom 0.6: v43.5,16 43.5,18 | 43.5,18 43.5,26.6 | v41.38,16 41.38,17.62 41.75,18 43.5,18 | v44.5,31.5 44.5,30.4 44.4,30.4 43.5,29.5 43.5,28.5 42.5,27.5 43,27 | v41.5,31.5 41.5,27.5 42,27 REG1.2.4